# EAGLE design SmartDriveTestStand_SingleCape (EAGLE 9.2.2)
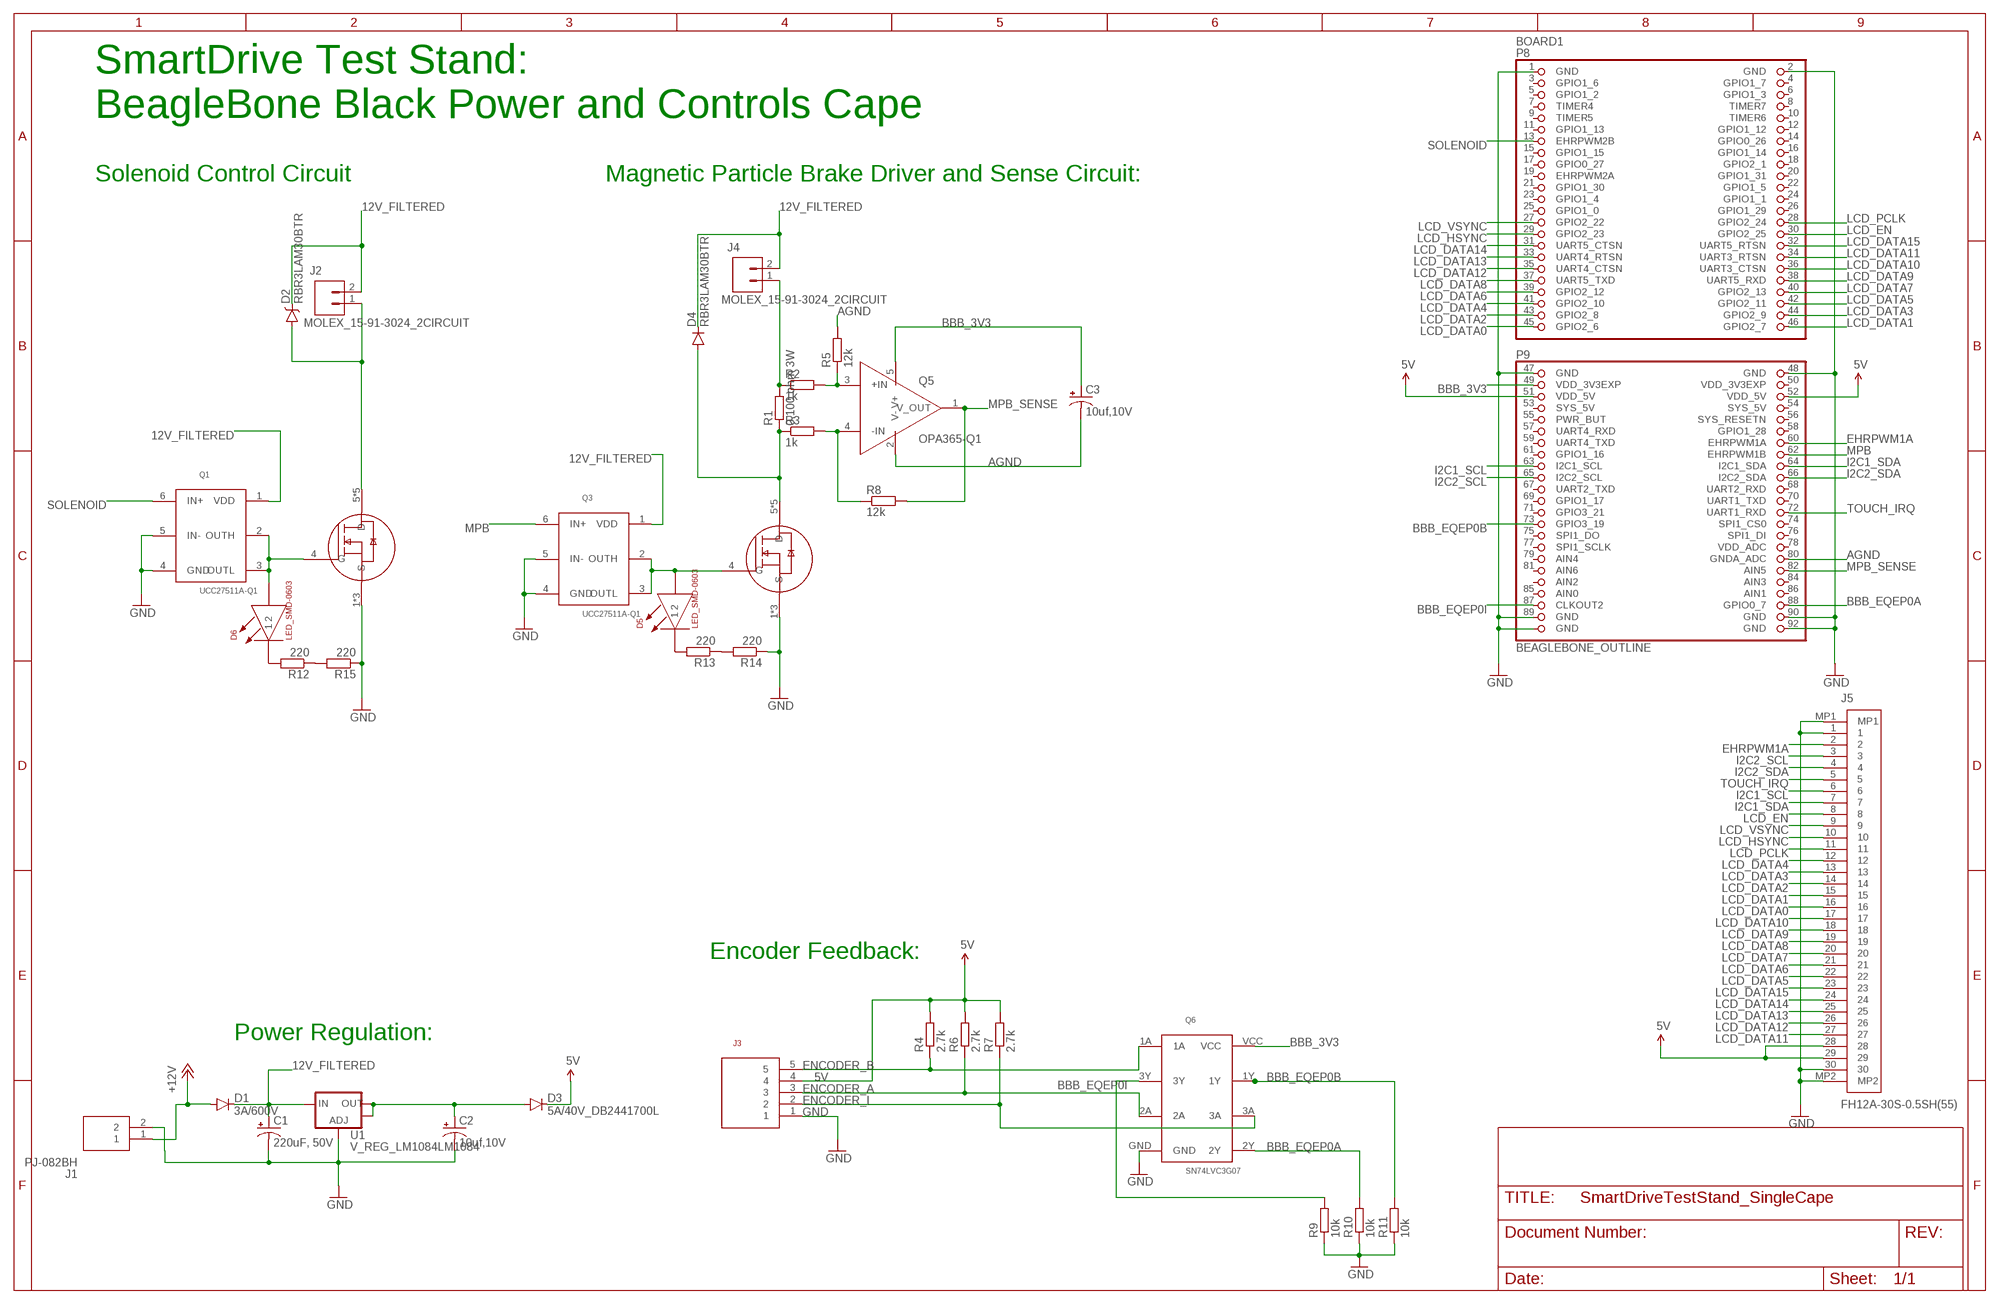
[diagram p0: schematic, sheet 1]

## Parts
BOARD1  BEAGLEBONE_OUTLINE  [BEAGLEBONE_SHIELD]
C1  220uF, 50V  CAP_POLG  [PANASONIC_G]
C2  10uf,10V  CAP_POL1206-KIT  [EIA3216-KIT]
C3  10uf,10V  CAP_POL1206-KIT  [EIA3216-KIT]
D1  3A/600V  DIODEES3J  [SMC]
D2  RBR3LAM30BTR  DIODE-SCHOTTKYRBR3LAM30B  [SMA-DIODE]
D3  5A/40V_DB2441700L  DIODESMA-ALT  [SMA-DIODE_ALT]
D4  RBR3LAM30BTR  DIODESMA  [SMA-DIODE]
D5  LED_SMD-0603  [0603_LED]
D6  LED_SMD-0603  [0603_LED]
J1  PJ-082BH  [PJ-082BH]
J2  MOLEX_15-91-3024_2CIRCUIT  [MOLEX15-91-3024_2CIRCUIT]
J3  MOLEX_15-91-3053_5CIRCUIT  [MOLEX15-91-3053-5CIRCUIT]
J4  MOLEX_15-91-3024_2CIRCUIT  [MOLEX15-91-3024_2CIRCUIT]
J5  FH12A-30S-0.5SH(55)  [FH12A30S05SH55]
Q1  UCC27511A-Q1  [SOT23-6]
Q2  MOSFET_NCHANNELTI_CSD18533Q5A  [SON_5X6MM_NEXFET]
Q3  UCC27511A-Q1  [SOT23-6]
Q4  MOSFET_NCHANNELTI_CSD18533Q5A  [SON_5X6MM_NEXFET]
Q5  OPA365-Q1  [SOT23-5]
Q6  SN74LVC3G07  [SN74LVC3G07]
R1  0.100 ohm 3W  RESISTOR-2512  [RESISTOR-2512]
R2  1k  RESISTOR-0603  [RESISTOR-0603]
R3  1k  RESISTOR-0603  [RESISTOR-0603]
R4  2.7k  RESISTOR-0603  [RESISTOR-0603]
R5  12k  RESISTOR-0603  [RESISTOR-0603]
R6  2.7k  RESISTOR-0603  [RESISTOR-0603]
R7  2.7k  RESISTOR-0603  [RESISTOR-0603]
R8  12k  RESISTOR-0603  [RESISTOR-0603]
R9  10k  RESISTOR-0603  [RESISTOR-0603]
R10  10k  RESISTOR-0603  [RESISTOR-0603]
R11  10k  RESISTOR-0603  [RESISTOR-0603]
R12  220  RESISTOR-0603  [RESISTOR-0603]
R13  220  RESISTOR-0603  [RESISTOR-0603]
R14  220  RESISTOR-0603  [RESISTOR-0603]
R15  220  RESISTOR-0603  [RESISTOR-0603]
U1  V_REG_LM1084LM1084  [TO-263-3]

## Nets
5V: BOARD1.51(VDD_5V) BOARD1.52(VDD_5V) D3.C J3.4 J5.28 J5.29 R4.P$2 R6.P$2 R7.P$2
12V_FILTERED: C1.+ D1.C D2.C D4.C J2.2 J4.2 Q1.1(VDD) Q3.1(VDD) U1.3(IN)
+12V: D1.A J1.1
AGND: BOARD1.80(GNDA_ADC) C3.C(-) Q5.2(V-) R5.P$2
BBB_3V3: BOARD1.49(VDD_3V3EXP) C3.A(+) Q5.5(V+) Q6.VCC
BBB_EQEP0A: BOARD1.88(GPIO0_7) Q6.2Y R10.P$2
BBB_EQEP0B: BOARD1.73(GPIO3_19) Q6.1Y R11.P$2
BBB_EQEP0I: BOARD1.87(CLKOUT2) Q6.3Y R9.P$2
EHRPWM1A: BOARD1.60(EHRPWM1A) J5.2
ENCODER_A: J3.3 Q6.2A R6.P$1
ENCODER_B: J3.5 Q6.1A R4.P$1
ENCODER_I: J3.2 Q6.3A R7.P$1
GND: BOARD1.1(GND) BOARD1.2(GND) BOARD1.47(GND) BOARD1.48(GND) BOARD1.89(GND) BOARD1.90(GND) BOARD1.91(GND) BOARD1.92(GND) C1.- C2.C(-) J1.2 J3.1 J5.1 J5.30 J5.MP1 J5.MP2 Q1.4(GND) Q1.5(IN-) Q2.1(S) Q2.2(S) Q2.3(S) Q3.4(GND) Q3.5(IN-) Q4.1(S) Q4.2(S) Q4.3(S) Q6.GND R9.P$1 R10.P$1 R11.P$1 R14.P$1 R15.P$1 U1.1(ADJ)
I2C1_SCL: BOARD1.63(I2C1_SCL) J5.6
I2C1_SDA: BOARD1.64(I2C1_SDA) J5.7
I2C2_SCL: BOARD1.65(I2C2_SCL) J5.3
I2C2_SDA: BOARD1.66(I2C2_SDA) J5.4
LCD_DATA0: BOARD1.45(GPIO2_6) J5.16
LCD_DATA1: BOARD1.46(GPIO2_7) J5.15
LCD_DATA2: BOARD1.43(GPIO2_8) J5.14
LCD_DATA3: BOARD1.44(GPIO2_9) J5.13
LCD_DATA4: BOARD1.41(GPIO2_10) J5.12
LCD_DATA5: BOARD1.42(GPIO2_11) J5.22
LCD_DATA6: BOARD1.39(GPIO2_12) J5.21
LCD_DATA7: BOARD1.40(GPIO2_13) J5.20
LCD_DATA8: BOARD1.37(UART5_TXD) J5.19
LCD_DATA9: BOARD1.38(UART5_RXD) J5.18
LCD_DATA10: BOARD1.36(UART3_CTSN) J5.17
LCD_DATA11: BOARD1.34(UART3_RTSN) J5.27
LCD_DATA12: BOARD1.35(UART4_CTSN) J5.26
LCD_DATA13: BOARD1.33(UART4_RTSN) J5.25
LCD_DATA14: BOARD1.31(UART5_CTSN) J5.24
LCD_DATA15: BOARD1.32(UART5_RTSN) J5.23
LCD_EN: BOARD1.30(GPIO2_25) J5.8
LCD_HSYNC: BOARD1.29(GPIO2_23) J5.10
LCD_PCLK: BOARD1.28(GPIO2_24) J5.11
LCD_VSYNC: BOARD1.27(GPIO2_22) J5.9
MPB: BOARD1.62(EHRPWM1B) Q3.6(IN+)
MPB_SENSE: BOARD1.82(AIN5) Q5.1(V_OUT) R8.P$2
N$1: R13.P$1 R14.P$2
N$2: D4.A Q4.5(D) Q4.6(D) Q4.7(D) Q4.8(D) Q4.PAD(D) R1.1 R3.P$1
N$3: D5.C R13.P$2
N$4: Q5.3(+IN) R2.P$2 R5.P$1
N$5: Q5.4(-IN) R3.P$2 R8.P$1
N$6: D6.C R12.P$2
N$7: D2.A J2.1 Q2.5(D) Q2.6(D) Q2.7(D) Q2.8(D) Q2.PAD(D)
N$8: J4.1 R1.2 R2.P$1
N$9: R12.P$1 R15.P$2
N$10: D5.A Q3.2(OUTH) Q3.3(OUTL) Q4.4(G)
N$11: D6.A Q1.2(OUTH) Q1.3(OUTL) Q2.4(G)
SOLENOID: BOARD1.13(EHRPWM2B) Q1.6(IN+)
TOUCH_IRQ: BOARD1.72(UART1_RXD) J5.5
VOUT: C2.A(+) D3.A U1.2(OUT) U1.4(OUT)
Unconnected: BOARD1.3(GPIO1_6) BOARD1.4(GPIO1_7) BOARD1.5(GPIO1_2) BOARD1.6(GPIO1_3) BOARD1.7(TIMER4) BOARD1.8(TIMER7) BOARD1.9(TIMER5) BOARD1.10(TIMER6) BOARD1.11(GPIO1_13) BOARD1.12(GPIO1_12) BOARD1.14(GPIO0_26) BOARD1.15(GPIO1_15) BOARD1.16(GPIO1_14) BOARD1.17(GPIO0_27) BOARD1.18(GPIO2_1) BOARD1.19(EHRPWM2A) BOARD1.20(GPIO1_31) BOARD1.21(GPIO1_30) BOARD1.22(GPIO1_5) BOARD1.23(GPIO1_4) BOARD1.24(GPIO1_1) BOARD1.25(GPIO1_0) BOARD1.26(GPIO1_29) BOARD1.54(SYS_5V) BOARD1.55(PWR_BUT) BOARD1.56(SYS_RESETN) BOARD1.57(UART4_RXD) BOARD1.58(GPIO1_28) BOARD1.59(UART4_TXD) BOARD1.61(GPIO1_16) BOARD1.67(UART2_TXD) BOARD1.68(UART2_RXD) BOARD1.69(GPIO1_17) BOARD1.70(UART1_TXD) BOARD1.71(GPIO3_21) BOARD1.74(SPI1_CS0) BOARD1.75(SPI1_DO) BOARD1.76(SPI1_DI) BOARD1.77(SPI1_SCLK) BOARD1.78(VDD_ADC) BOARD1.79(AIN4) BOARD1.81(AIN6) BOARD1.83(AIN2) BOARD1.84(AIN3) BOARD1.86(AIN1)

## Notes on the sheet
- SmartDrive Test Stand: 
  BeagleBone Black Power and Controls Cape
- Solenoid Control Circuit | Magnetic Particle Brake Driver and Sense Circuit:
- Encoder Feedback:
- Power Regulation:

## Power pins joined to a net without a drawn wire
AIN0: BOARD1.85(AIN0)
SYS_5V: BOARD1.53(SYS_5V)
VDD_3V3EXP: BOARD1.50(VDD_3V3EXP)

## Library data of the parts
BOARD1 = SmartDrive-TestStand:BEAGLEBONE_OUTLINE: Should match A3 pinout - but not completely tested
C1 = SmartDrive-TestStand:CAP_POL: Capacitor Polarized These are standard SMD and PTH capacitors. Normally 10uF, 47uF, and 100uF in electrolytic and tantalum varieties. Always verify the external diameter of the through hole cap, it varies with capacity, voltage, and manufacturer. The EIA devices should be standard.; MANEX: 123-0004264
C2 C3 = SmartDrive-TestStand:CAP_POL: Capacitor Polarized These are standard SMD and PTH capacitors. Normally 10uF, 47uF, and 100uF in electrolytic and tantalum varieties. Always verify the external diameter of the through hole cap, it varies with capacity, voltage, and manufacturer. The EIA devices should be standard.; MANEX: 123-0001192
D1 = SmartDrive-TestStand:DIODE: Diode These are standard reverse protection diodes and small signal diodes. SMA package can handle up to about 1A. SOD-323 can handle about 200mA. What the SOD-323 package when ordering, there are some mfgs out there that are 5-pin packages.; MANEX: 130-0001388; PROD_ID: DIO-12441
D2 = SmartDrive-TestStand:DIODE-SCHOTTKY: Schottky diodes
D3 = SmartDrive-TestStand:DIODE: Diode These are standard reverse protection diodes and small signal diodes. SMA package can handle up to about 1A. SOD-323 can handle about 200mA. What the SOD-323 package when ordering, there are some mfgs out there that are 5-pin packages.; MANEX: 130-0002546
D4 = SmartDrive-TestStand:DIODE: Diode These are standard reverse protection diodes and small signal diodes. SMA package can handle up to about 1A. SOD-323 can handle about 200mA. What the SOD-323 package when ordering, there are some mfgs out there that are 5-pin packages.
D5 D6 = SmartDrive-TestStand:LED_SMD-0603
J1 = SmartDrive-TestStand:PJ-082BH: DC Power Connectors 2.5mm x 5.5mm horz Source: Datasheet <https://componentsearchengine.com/Datasheets/1/PJ-082BH.pdf>; DESCRIPTION: DC Power Connectors 2.5mm x 5.5mm horz; HEIGHT: mm; MANUFACTURER_NAME: CUI; MANUFACTURER_PART_NUMBER: PJ-082BH; MOUSER_PART_NUMBER: 490-PJ-082BH
J2 J4 = SmartDrive-TestStand:MOLEX_15-91-3024_2CIRCUIT: MOLEX 15-91-3024 2 position connector; MANEX: 257-0004040
J3 = SmartDrive-TestStand:MOLEX_15-91-3053_5CIRCUIT
J5 = SmartDrive-TestStand:FH12A-30S-0.5SH(55): Hirose FH12 Series 0.5mm Pitch 30 Way 1 Row Right Angle SMT Female FPC Connector, Gold Plated Contacts Source: Datasheet <https://www.hirose.com/product/en/download_file/key_name/FH12A-30S-0.5SH(55)/category/Drawing (2D)/doc_file_id/43793/?file_category_id=6&item_id=05860556555&is_series=>; ARROW_PART_NUMBER: FH12A-30S-0.5SH(55); ARROW_PRICE-STOCK: https://www.arrow.com/en/products/fh12a-30s-0.5sh-55/hirose-electric; DESCRIPTION: Hirose FH12 Series 0.5mm Pitch 30 Way 1 Row Right Angle SMT Female FPC Connector, Gold Plated Contacts; HEIGHT: 3.6mm; MANUFACTURER_NAME: Hirose; MANUFACTURER_PART_NUMBER: FH12A-30S-0.5SH(55); RS_PART_NUMBER: 7148083P; RS_PRICE-STOCK: http://uk.rs-online.com/web/p/products/7148083P
Q1 Q3 = SmartDrive-TestStand:UCC27511A-Q1
Q2 Q4 = SmartDrive-TestStand:MOSFET_NCHANNEL: N-Channel QFET MOSFET FQB30N06L 60V, 32A, 35mOhm
Q5 = SmartDrive-TestStand:OPA365-Q1: OPA365-Q1 50MHz Low-Distortion High-CMRR Rail-to-Rail I/O, Single-Supply Operational Amplifier
Q6 = SmartDrive-TestStand:SN74LVC3G07
R1 = SmartDrive-TestStand:RESISTOR-2512: Resistor SMD 2512
R2-R15 = SmartDrive-TestStand:RESISTOR-0603: Resistor 0603 SMD
U1 = SmartDrive-TestStand:V_REG_LM1084: LM1084 5A low-drop positive voltage regulator The LM1084xx is a low drop voltage regulator able to provide up to 5 A of output current. Dropout is guaranteed at a maximum of 1.5 V at the maximum output current, decreasing at lower loads. The LM1084xx is pin to pin compatible with the older 3-terminal adjustable regulators, but has better performances in term of drop and output tolerance.

## Net classes
0 default: width 0.152 mm, drill 0.305 mm, clearance 0.152 mm

## Board
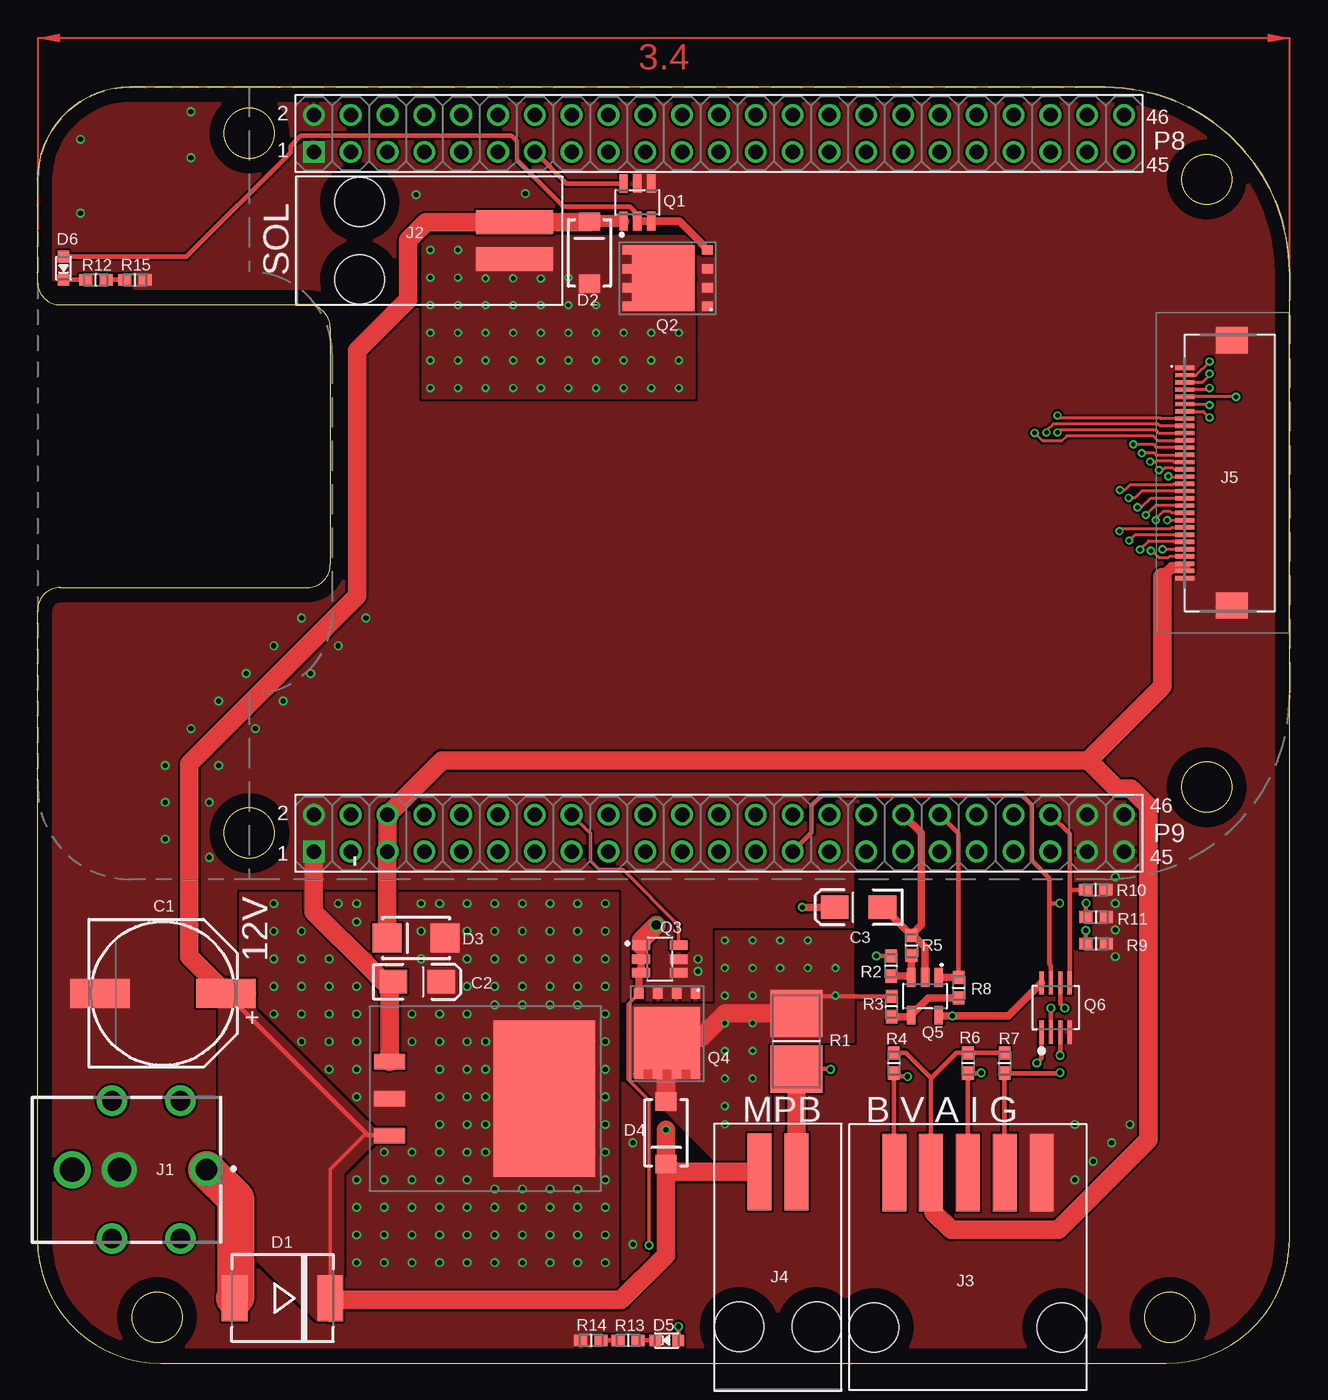
[diagram p1: board, top side]
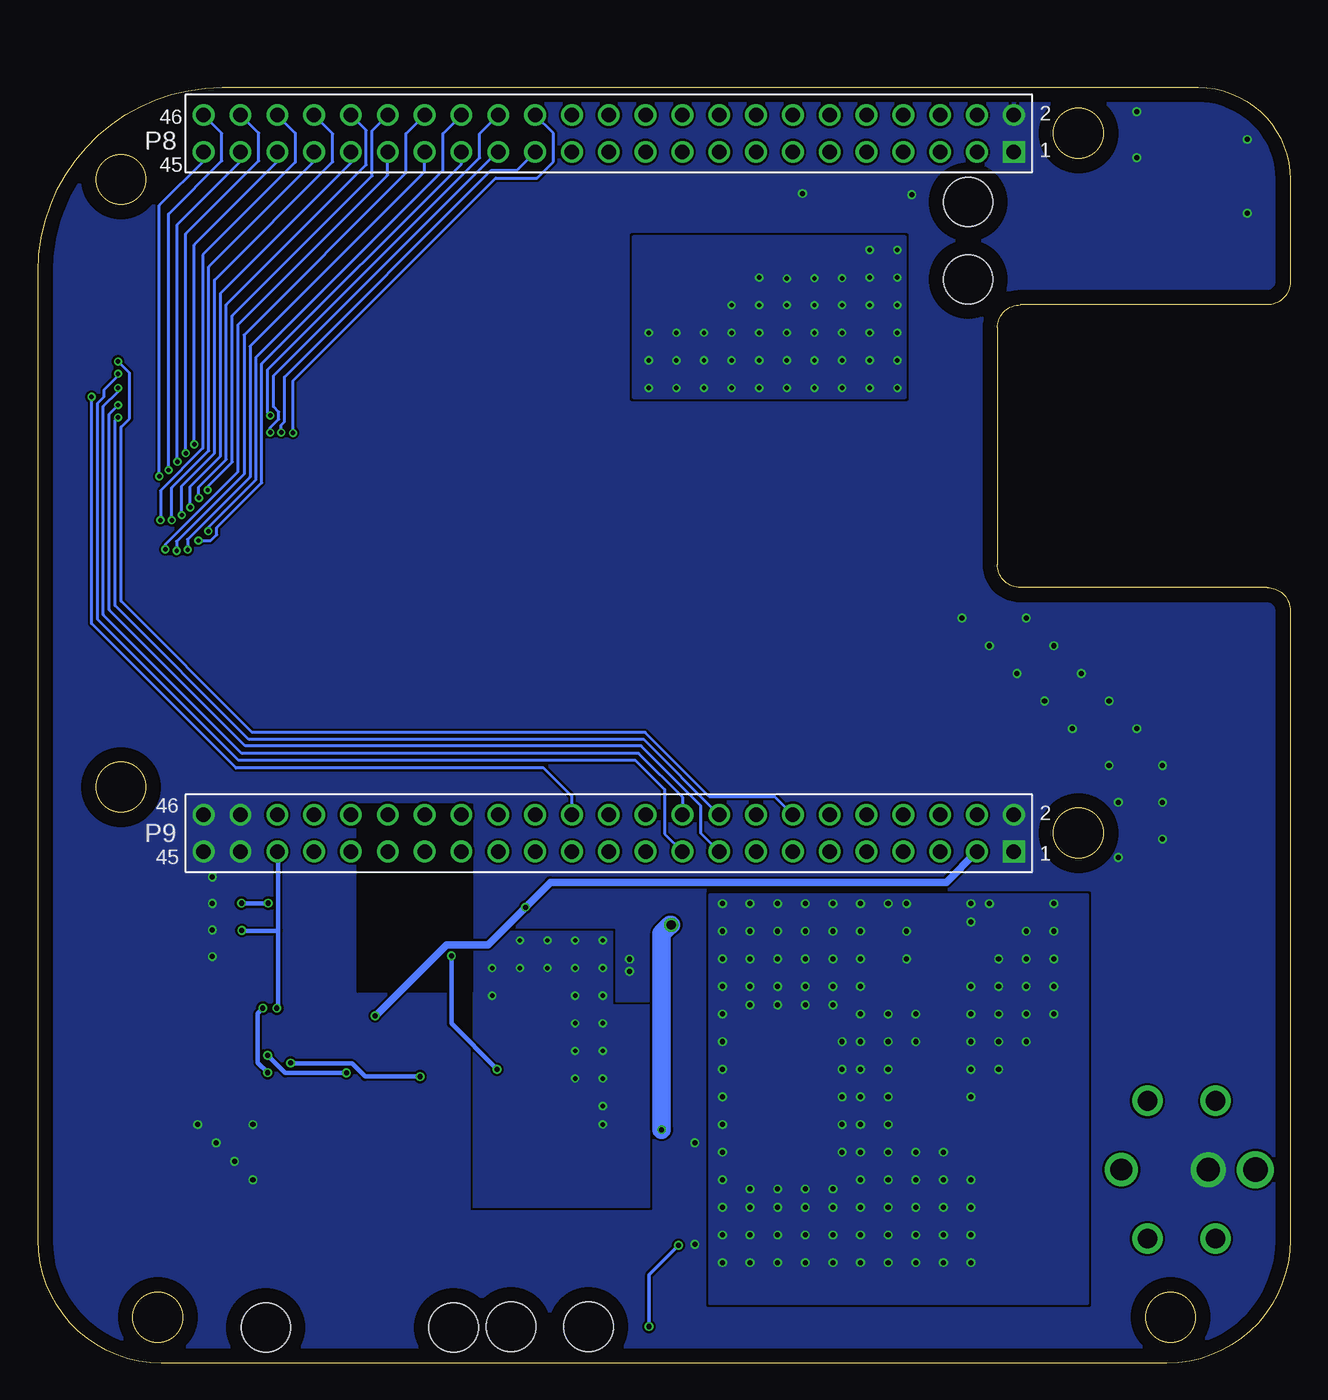
[diagram p2: board, bottom side, seen from below]

Size 86.36 x 88 mm. Coordinates in mm from the lower left corner, seen from the top.
Outline: 0,8.5 arc90 8.5,0 77.86,0 arc90 86.36,8.5 86.36,75.3 arc90 73.66,88 6.35,88 arc90 0,81.65 0,74.59 arc90 1.59,73 18.61,73 arc-90 20.2,71.41 20.2,55.09 arc-90 18.61,53.5 1.59,53.5 arc90 0,51.91 0,8.5
Outline: circle at 14.61,84.83 radius 1.73
Outline: circle at 80.65,81.65 radius 1.73
Outline: circle at 80.65,39.74 radius 1.73
Outline: circle at 14.61,36.56 radius 1.73
Outline: circle at 8.26,3.17 radius 1.73
Outline: circle at 78.11,3.17 radius 1.73
Copper layers (1*16): Top 0.035mm / dielectric 1.5mm / Bottom 0.035mm
Design rules "default *": minimum track width 6mil, minimum drill 10mil, track to track 6mil, track to pad 6mil, pad to pad 6mil, via to via 6mil, smd to smd 6mil, copper to edge 40mil, drill to drill 6mil, minimum pad ring 5mil, minimum via ring 5mil, stop-mask expansion 4mil, vias tented up to drill 0mil, thermal gap 0mil

### Footprints (pad centres in the part's own frame; a part is rotated, then mirrored left to right if it is on the bottom)
BEAGLEBONE_SHIELD = drill 1 square: 1 4.445,19.05; 47 52.705,19.05 | drill 1: 2 1.905,19.05; 3 4.445,21.59; 4 1.905,21.59; 5 4.445,24.13; 6 1.905,24.13; 7 4.445,26.67; 8 1.905,26.67; 9 4.445,29.21; 10 1.905,29.21; 11 4.445,31.75; 12 1.905,31.75; 13 4.445,34.29; 14 1.905,34.29; 15 4.445,36.83; 16 1.905,36.83; 17 4.445,39.37; 18 1.905,39.37; 19 4.445,41.91; 20 1.905,41.91; 21 4.445,44.45; 22 1.905,44.45; 23 4.445,46.99; 24 1.905,46.99; 25 4.445,49.53; 26 1.905,49.53; 27 4.445,52.07; 28 1.905,52.07; 29 4.445,54.61; 30 1.905,54.61; 31 4.445,57.15; 32 1.905,57.15; 33 4.445,59.69; 34 1.905,59.69; 35 4.445,62.23; 36 1.905,62.23; 37 4.445,64.77; 38 1.905,64.77; 39 4.445,67.31; 40 1.905,67.31; 41 4.445,69.85; 42 1.905,69.85; 43 4.445,72.39; 44 1.905,72.39; 45 4.445,74.93; 46 1.905,74.93; 48 50.165,19.05; 49 52.705,21.59; 50 50.165,21.59; 51 52.705,24.13; 52 50.165,24.13; 53 52.705,26.67; 54 50.165,26.67; 55 52.705,29.21; 56 50.165,29.21; 57 52.705,31.75; 58 50.165,31.75; 59 52.705,34.29; 60 50.165,34.29; 61 52.705,36.83; 62 50.165,36.83; 63 52.705,39.37; 64 50.165,39.37; 65 52.705,41.91; 66 50.165,41.91; 67 52.705,44.45; 68 50.165,44.45; 69 52.705,46.99; 70 50.165,46.99; 71 52.705,49.53; 72 50.165,49.53; 73 52.705,52.07; 74 50.165,52.07; 75 52.705,54.61; 76 50.165,54.61; 77 52.705,57.15; 78 50.165,57.15; 79 52.705,59.69; 80 50.165,59.69; 81 52.705,62.23; 82 50.165,62.23; 83 52.705,64.77; 84 50.165,64.77; 85 52.705,67.31; 86 50.165,67.31; 87 52.705,69.85; 88 50.165,69.85; 89 52.705,72.39; 90 50.165,72.39; 91 52.705,74.93; 92 50.165,74.93
PANASONIC_G = smd 4.1 x 2: + 4.35,0; - -4.35,0
EIA3216-KIT = smd 1.9 x 1.6: A 1.65,0; C -1.65,0
SMC = smd 1.778 x 3.175: A 3.302,0; C -3.302,0
SMA-DIODE = smd 1.27 x 1.47: A -2.15,0; C 2.15,0
SMA-DIODE_ALT = smd 2 x 2: A -2,0; C 2,0
0603_LED = smd 0.8 x 0.8: A 0.8,0; C -0.8,0
PJ-082BH = drill 1.5 pad 2.3: 1 12,0 | drill 1.61 pad 2.4: 2 6,0 | drill 1.7 pad 2.5: 3 2.75,0 | drill 1.35 pad 2.1: 4 5.5,4.75; 5 10.2,4.75; 6 10.2,-4.75; 7 5.5,-4.75
MOLEX15-91-3024_2CIRCUIT = smd 1.65 x 5.33: 1 1.27,10.69; 2 -1.27,10.69 | hole 3.4: 2.67,0; -2.67,0
MOLEX15-91-3053-5CIRCUIT = smd 1.65 x 5.33: 1 5.08,10.69; 2 2.54,10.69; 3 0,10.69; 4 -2.54,10.69; 5 -5.08,10.69 | hole 3.4: 6.48,0; -6.48,0
FH12A30S05SH55 = smd 0.3 x 1.3: 1 -7.25,-2.625; 2 -6.75,-2.625; 3 -6.25,-2.625; 4 -5.75,-2.625; 5 -5.25,-2.625; 6 -4.75,-2.625; 7 -4.25,-2.625; 8 -3.75,-2.625; 9 -3.25,-2.625; 10 -2.75,-2.625; 11 -2.25,-2.625; 12 -1.75,-2.625; 13 -1.25,-2.625; 14 -0.75,-2.625; 15 -0.25,-2.625; 16 0.25,-2.625; 17 0.75,-2.625; 18 1.25,-2.625; 19 1.75,-2.625; 20 2.25,-2.625; 21 2.75,-2.625; 22 3.25,-2.625; 23 3.75,-2.625; 24 4.25,-2.625; 25 4.75,-2.625; 26 5.25,-2.625; 27 5.75,-2.625; 28 6.25,-2.625; 29 6.75,-2.625; 30 7.25,-2.625 | smd 1.8 x 2.2: MP1 -9.15,0.625; MP2 9.15,0.625
SOT23-6 = smd 1.27 x 0.635: 1 -1.3,0.95; 2 -1.3,0; 3 -1.3,-0.95; 4 1.3,-0.95; 5 1.3,0; 6 1.3,0.95
SON_5X6MM_NEXFET = smd 0.75 x 0.65: 1 3.075,-1.95; 2 3.075,-0.65; 3 3.075,0.65; 4 3.075,1.95 | smd 0.65 x 0.65: 5 -2.475,1.95; 6 -2.475,0.65; 7 -2.475,-0.65; 8 -2.475,-1.95 | smd 4.3 x 4.55: PAD 0,0
SOT23-5 = smd 1.27 x 0.635: 1 -1.3,0.95; 2 -1.3,0; 3 -1.3,-0.95; 4 1.3,-0.95; 5 1.3,0.95
SN74LVC3G07 = smd 0.3 x 1.6: 1A -0.975,-1.7; 1Y -0.325,1.7; 2A 0.325,-1.7; 2Y 0.975,1.7; 3A 0.325,1.7; 3Y -0.325,-1.7; GND 0.975,-1.7; VCC -0.975,1.7
RESISTOR-2512 = smd 3.25 x 3.6: 1 -1.925,0; 2 1.925,0
RESISTOR-0603 = smd 0.9 x 0.8: P$1 -0.7,0; P$2 0.7,0
TO-263-3 = smd 1.07 x 2.16: 1 -2.54,-14.17; 2 0,-14.17; 3 2.54,-14.17 | smd 10.8 x 7: 4 0,-3.5

### Placement (x,y rotation side)
BOARD1  0.01,88 270 top
C1  8.66,25.52 0 top
C2  26.2,26.31 0 top
C3  56.63,31.45 180 top
D1  16.9,4.49 180 top
D2  38.07,76.59 90 top
D3  26.11,29.32 180 top
D4  43.36,15.89 270 top
D5  43.4,1.58 0 top
D6  1.8,75.52 90 top
DRILEGEND  [DRILEGEND]  10.55,33.13 0 top
J1  -0.35,13.35 0 top
J2  22.22,77.43 270 top
J3  64.18,2.47 0 top
J4  51.07,2.51 0 top
J5  81.76,61.4 270 top
Q1  41.37,80.07 90 top
Q2  43.15,74.83 0 top
Q3  42.93,27.88 0 top
Q4  43.44,22.43 90 top
Q5  61.22,25.32 270 top
Q6  70.23,24.54 0 top
R1  52.34,22.22 270 top
R2  58.88,27.4 270 top
R3  58.91,24.61 270 top
R4  59.06,20.71 90 top
R5  60.28,28.82 90 top
R6  64.17,20.71 90 top
R7  66.7,20.71 90 top
R8  63.53,25.9 90 top
R9  73.02,28.94 180 top
R10  72.99,32.66 180 top
R11  73.02,30.79 180 top
R12  4.03,74.72 180 top
R13  40.74,1.58 0 top
R14  38.17,1.58 0 top
R15  6.73,74.72 180 top
U1  38.45,18.25 270 top

### Tracks (layer width: path | path; a pad name or v marks a point on that pad's centre or on a via)
5V
  Top 0.254: 79.14,54.88 J5.29 J5.28
  Top 0.305: R7.P$2 R6.P$2 63.39,21.41 61.64,19.66 J3.4 61.64,19.67 59.9,21.41 R4.P$2
  Top 0.762: 77.59,54.24 78.24,54.88 79.14,54.88
  Top 1.27: 72.49,41.59 27.9,41.59 BOARD1.52 BOARD1.51 24.11,35.26 D3.C | 72.49,41.59 77.59,46.69 77.59,54.24 | 72.49,41.59 74.43,39.65 75.4,39.65 76.61,38.44 76.61,15.4 70.41,9.2 63.03,9.2 61.8,10.42 61.8,12.99 J3.4
12V_FILTERED  (via drill 0.35, 0.65)
  Top 0.254: D1.C 20.2,13.38 22.53,15.71 U1.3
  Top 0.305: C1.+ 22.82,15.71 U1.3
  Top 0.508: 38.19,78.77 38.11,78.7
  Top 0.813: Q1.1 38.19,78.77
  Top 1.27: C1.+ 10.47,28.06 10.47,41.33 22.04,52.9 22.04,69.84 25.57,73.37 25.57,77.45 26.82,78.69 J2.2 38.03,78.69 D2.C 38.11,78.7 | D4.C 43.36,7.45 40.27,4.36 20.33,4.36 D1.C | D4.C 43.89,13.2 J4.2 | D4.C v43.36,16.11 v43.35,16.11 | Q3.1 arc0 41.63,29.17 v42.69,30.23
  Bottom 1.27: v43.35,16.11 43.35,29.65 42.77,30.23 v42.69,30.23
  pour Top: 12.49,26.52 12.49,9.73 19.33,2.9 21.1,2.9 21.1,13.09 23.19,15.17 23.19,16.21 15.06,24.34 15.06,26.52
+12V
  Top 2.54: J1.1 13.67,11.32 13.67,4.56 D1.A
AGND
  Top 0.508: R5.P$2 60.96,30.22 60.96,36.57 BOARD1.80 | R5.P$2 58.35,31.45 C3.C | R5.P$2 60.4,29.52 61.22,28.71 Q5.2
AGND_CUTOUT
  cutout Top: 56.43,25.61 56.43,38.56 63.55,38.56 63.55,25.61
  cutout Bottom: 56.43,38.56 56.43,25.61 64.31,25.61 64.31,38.56
BBB_3V3  (via drill 0.35)
  Top 0.508: v52.75,31.45 C3.A | Q6.VCC 66.97,23.96 v63.11,23.96 62.23,23.96 Q5.5
  Bottom 0.508: v63.11,23.96 63.09,23.96 58.19,28.86 55.34,28.86 v52.75,31.45 51.02,33.18 23.72,33.18 BOARD1.49
BBB_EQEP0A
  Top 0.305: Q6.2Y 71.2,32.52 | 71.2,32.52 71.2,36.49 BOARD1.88 | R10.P$2 71.34,32.66 71.2,32.52
BBB_EQEP0B  (via drill 0.35)
  Top 0.305: 69.8,31.73 69.8,27.54 69.9,27.44 Q6.1Y | 69.8,31.73 69.8,33.45 68.58,34.68 68.58,38.51 67.92,39.17 54.1,39.17 53.39,38.46 53.39,36.61 BOARD1.73 | R11.P$2 72.32,31.71 v72.33,31.73 | v70.5,31.73 69.8,31.73
  Bottom 0.305: v72.33,31.73 v70.5,31.73
BBB_EQEP0I  (via drill 0.35)
  Top 0.305: Q6.3Y v69.9,24.49 | R9.P$2 72.31,28.95 v72.31,29.85
  Bottom 0.305: 69.79,29.83 72.29,29.83 v72.31,29.85 | 69.79,29.83 69.79,24.59 v69.9,24.49 | BOARD1.87 69.79,35.22 69.79,29.83
EHRPWM1A  (via drill 0.3)
  Top 0.203: J5.2 79.9,68.15 v80.84,69.09
  Bottom 0.203: v80.84,69.09 80.06,68.31 80.06,65.16 80.64,64.58 80.64,52.56 71.6,43.52 44.49,43.52 40.07,39.1 35.57,39.1 BOARD1.60
ENCODER_A  (via drill 0.35)
  Top 0.305: J3.3 R6.P$1 65.08,20.01 v65.1,20.02 | v70.53,21.24 70.55,21.26 Q6.2A
  Bottom 0.305: v65.1,20.02 69.32,20.02 v70.53,21.24
ENCODER_B  (via drill 0.35)
  Top 0.305: J3.5 59.06,13.2 R4.P$1 59.3,19.77 v60.01,19.77 | v68.94,20.7 69.25,21.02 Q6.1A
  Bottom 0.305: v60.01,19.77 63.81,19.77 64.72,20.68 68.91,20.68 v68.94,20.7
ENCODER_I  (via drill 0.35)
  Top 0.305: J3.2 66.7,13.18 R7.P$1 70.49,20.01 v70.53,20.05 | Q6.3A 70.56,24.8 v70.86,24.49
  Bottom 0.305: v70.86,24.49 71.22,24.14 71.22,20.94 71.22,20.73 v70.53,20.05
GND  (via drill 0.35)
  Top 1.27: U1.1 24.28,26.04 C2.C 23.89,26.31 22.91,27.29 19.06,31.13 BOARD1.47
  other vias: 75.36,16.47 74.09,15.2 72.82,13.93 71.55,12.66 71.55,16.47 74.34,28.05 74.34,29.89 74.34,31.71 74.34,33.53 45.56,27.87 45.56,27.03 15.03,43.77 16.94,45.68 18.84,47.58 20.75,49.49 22.65,51.39 18.21,51.39 16.3,49.49 14.4,47.58 12.49,45.68 10.59,43.77 8.81,41.23 8.81,38.69 8.81,36.15 12.49,41.23 11.86,38.69 11.86,34.88 41.07,15.2 41.07,8.21 26.11,80.6 33.65,80.68 10.59,83.14 10.59,86.32 2.97,84.41 2.97,79.33
  pour Bottom (rank 6): -0.34,89.01 -0.34,-1.49 91.2,-1.49 91.2,89.01
  pour Top (rank 6): -0.11,89.01 -0.11,-1.41 91.17,-1.41 91.17,89.01
I2C1_SCL  (via drill 0.3)
  Top 0.203: J5.6 79.16,66.13 80.8,66.13 v80.84,66.08
  Bottom 0.203: v80.84,66.08 81.45,65.47 81.45,51.96 72.07,42.58 44.78,42.58 40.66,38.46 40.66,36.57 BOARD1.63
I2C1_SDA  (via drill 0.3)
  Top 0.203: J5.7 80.43,65.65 v80.84,65.23
  Bottom 0.203: BOARD1.64 44.59,43.03 71.82,43.03 81.05,52.26 81.05,65.03 v80.84,65.23
I2C2_SCL  (via drill 0.3)
  Top 0.203: J5.3 80.33,67.65 80.84,68.16 v80.84,68.24
  Bottom 0.203: v80.84,68.24 80.84,68.1 81.81,67.14 81.81,66.66 82.27,66.21 82.27,51.31 72.54,41.59 45.16,41.59 43.15,39.58 43.15,36.52 BOARD1.65
I2C2_SDA  (via drill 0.3)
  Top 0.203: J5.4 80.73,67.15 v80.84,67.27
  Bottom 0.203: v80.84,67.27 80.84,67.02 81.86,66.01 81.86,51.61 72.32,42.07 44.94,42.07 41.92,39.05 BOARD1.66
LCD_DATA0  (via drill 0.3)
  Top 0.203: J5.16 79.11,61.13 78.04,61.13 v78,61.17
  Bottom 0.203: v78,61.17 78,79.86 74.94,82.92 BOARD1.45
LCD_DATA1  (via drill 0.3)
  Top 0.203: v77.36,61.6 77.41,61.65 77.65,61.65 77.75,61.75 78.3,61.75 78.4,61.65 J5.15
  Bottom 0.203: v77.36,61.6 77.36,79.25 73.69,82.93 73.69,84.83 BOARD1.46
LCD_DATA2  (via drill 0.3)
  Top 0.203: v76.75,62.19 76.79,62.15 77.11,62.15 77.17,62.21 78.34,62.21 78.4,62.15 J5.14
  Bottom 0.203: v76.75,62.19 76.75,78.54 72.4,82.89 BOARD1.43
LCD_DATA3  (via drill 0.3)
  Top 0.203: v76.17,62.77 77.04,62.77 77.19,62.62 79.11,62.62 J5.13
  Bottom 0.203: v76.17,62.77 76.17,77.91 71.14,82.94 71.14,84.84 72.39,86.09 BOARD1.44
LCD_DATA4  (via drill 0.3)
  Top 0.203: J5.12 77.19,63.15 76.98,63.35 75.61,63.35 v75.59,63.38
  Bottom 0.203: v75.59,63.38 75.59,77.14 69.86,82.87 BOARD1.41
LCD_DATA5  (via drill 0.3)
  Top 0.203: v77.92,58.15 J5.22
  Bottom 0.203: BOARD1.42 68.63,84.85 68.63,82.84 75,76.46 75,63.11 77.92,60.19 v77.92,58.15
LCD_DATA6  (via drill 0.3)
  Top 0.203: J5.21 78.22,58.65 78.14,58.73 77.62,58.73 77.14,58.25 v77.14,58.15
  Bottom 0.203: v77.14,58.15 77.14,60.39 74.6,62.93 74.6,75.62 67.32,82.89 BOARD1.39
LCD_DATA7  (via drill 0.3)
  Top 0.203: J5.20 77.1,59.15 v76.45,58.5
  Bottom 0.203: v76.45,58.5 76.45,60.5 74.19,62.76 74.19,74.71 66.04,82.86 66.04,84.8 BOARD1.40
LCD_DATA8  (via drill 0.3)
  Top 0.203: J5.19 76.76,59.65 76.14,59.04 v75.87,59.04
  Bottom 0.203: v75.87,59.04 75.87,60.48 73.78,62.56 73.78,73.79 64.78,82.79 BOARD1.37
LCD_DATA9  (via drill 0.3)
  Top 0.203: J5.18 76.17,60.15 75.7,59.69 v75.27,59.69
  Bottom 0.203: v75.27,59.69 75.27,60.45 73.38,62.34 73.38,73.01 63.72,82.66 63.72,85.03 BOARD1.38
LCD_DATA10  (via drill 0.3)
  Top 0.203: J5.17 78.38,60.65 78.3,60.57 75.35,60.57 74.99,60.22 v74.66,60.22
  Bottom 0.203: v74.66,60.22 74.66,60.47 72.97,62.17 72.97,72.25 63.32,81.9 63.32,85.02 BOARD1.36
LCD_DATA11  (via drill 0.3)
  Top 0.203: J5.27 78.09,55.66 77.99,55.56 77.35,55.56 76.86,56.04 v76.81,56.04
  Bottom 0.203: v76.81,56.04 76.81,56.67 72.16,61.32 72.16,70.93 60.99,82.1 60.99,84.81 BOARD1.34
LCD_DATA12  (via drill 0.3)
  Top 0.203: J5.26 77.6,56.15 v77.59,56.14
  Bottom 0.203: v77.59,56.14 77.59,56.46 72.56,61.49 72.56,71.63 62.24,81.95 BOARD1.35
LCD_DATA13  (via drill 0.3)
  Top 0.203: v76.05,56.12 76.65,56.72 78.35,56.72 78.43,56.65 J5.25
  Bottom 0.203: v76.05,56.12 76.05,56.83 71.75,61.12 71.75,70.14 59.7,82.18 BOARD1.33
LCD_DATA14  (via drill 0.3)
  Top 0.203: J5.24 75.71,57.15 v75.3,56.74
  Bottom 0.203: v75.3,56.74 74.45,56.74 74.04,57.15 74.04,57.63 70.94,60.74 70.94,68.94 57.16,82.72 BOARD1.31
LCD_DATA15  (via drill 0.3)
  Top 0.203: v74.63,57.39 74.8,57.56 78.16,57.56 78.25,57.65 J5.23
  Bottom 0.203: v74.63,57.39 74.63,57.64 71.34,60.93 71.34,69.37 58.44,82.28 58.44,84.81 BOARD1.32
LCD_EN  (via drill 0.3)
  Top 0.203: v70.35,65.37 70.52,65.2 77.46,65.2 77.51,65.15 J5.8
  Bottom 0.203: v70.35,65.37 70.53,65.55 70.53,68.52 55.9,83.15 55.9,84.81 BOARD1.30
LCD_HSYNC  (via drill 0.3)
  Top 0.203: J5.10 77.36,64.15 77.13,64.38 70.54,64.38 v70.35,64.19
  Bottom 0.203: v70.35,64.19 70.35,64.52 69.77,65.11 69.77,65.61 70.13,65.97 70.13,68.1 54.68,83.55 BOARD1.29
LCD_PCLK  (via drill 0.3)
  Top 0.203: J5.11 79.09,63.61 77.31,63.61 76.95,63.96 70.98,63.96 70.63,63.61 69.34,63.61 v68.78,64.17
  Bottom 0.203: v68.78,64.17 68.78,67.77 54.81,81.74 51.96,81.74 50.82,82.89 50.82,84.83 BOARD1.28
LCD_VSYNC  (via drill 0.3)
  Top 0.203: J5.9 77.44,64.65 77.3,64.79 70.06,64.79 69.59,64.32 v69.59,64.19
  Bottom 0.203: v69.59,64.19 69.59,64.71 69.36,64.94 69.36,68.03 55.11,82.28 53.33,82.28 52.08,83.53 BOARD1.27
MPB
  Top 0.254: BOARD1.62 38.13,36.54 38.13,34.66 38.75,34.04 40.38,34.04 44.23,30.19 Q3.6
MPB_SENSE
  Top 0.305: R8.P$2 63.53,36.55 BOARD1.82
  Top 0.508: Q5.1 63.51,26.62 R8.P$2
N$1
  Top 0.305: R13.P$1 R14.P$2
N$2  (via drill 0.3)
  Top 0.254: Q4.6 43.36,19.38 D4.A
  Top 0.305: R1.1 53.51,25.31 R3.P$1
  Top 0.762: Q4.5 Q4.6 Q4.7 Q4.8
  Top 1.27: R1.1 47.45,24.14 45.73,22.43 Q4.PAD 43.36,22.35 D4.A
  other vias: 47.42,29.17 49.32,29.17 51.23,29.17 53.13,29.17 47.42,27.26 49.32,27.26 51.23,27.26 53.13,27.26 55.04,27.26 55.04,25.36 49.32,25.36 49.32,23.45 49.32,21.55 49.32,19.64 47.42,17.74 47.42,16.47 47.42,19.64 47.42,21.55 47.42,23.45 47.42,25.36
  pour Top: 41.07,24.72 41.07,19.64 46.78,13.93 50.59,13.93 50.59,22.18 56.31,22.18 56.31,29.8 46.78,29.8 46.78,24.72
  pour Bottom: 46.78,29.8 46.78,24.72 42.87,24.72 42.87,19.64 44.24,19.64 44.24,10.75 56.31,10.75 56.31,29.8
N$3
  Top 0.305: D5.C R13.P$2
N$4
  Top 0.508: R2.P$2 60.19,26.7 Q5.3 60.27,28.11 R5.P$1
N$5
  Top 0.508: R3.P$2 60.16,23.91 Q5.4 61.45,25.2 R8.P$1
N$6
  Top 0.305: D6.C | D6.C R12.P$2
N$7  (via drill 0.3)
  Top 0.254: Q2.7 42.5,74.18 Q2.PAD
  other vias: 27.1,67.27 29,67.27 30.91,67.27 32.81,67.27 34.72,67.27 36.62,67.27 38.53,67.27 40.43,67.27 42.34,67.27 44.24,67.27 44.24,69.17 44.24,71.08 42.34,71.08 40.43,71.08 38.53,71.08 38.53,72.98 27.1,69.17 27.1,71.08 27.1,72.98 27.1,74.89 27.1,76.79 29,76.79 29,74.89 29,72.98 29,71.08 29,69.17 30.91,69.17 30.91,71.08 30.91,72.98 30.91,74.84 32.81,74.84 32.81,72.98 32.81,71.08 32.81,69.17 34.72,69.17 34.72,71.08 34.72,72.98 34.72,74.81 36.62,74.89 36.62,72.98 36.62,71.08 36.62,69.17 38.53,69.17 40.43,69.17 42.34,69.17
  pour Top: 26.59,77.73 45.28,77.73 45.28,66.58 26.59,66.58
  pour Bottom: 26.59,66.58 45.28,66.58 45.28,77.73 26.59,77.73
N$8  (via drill 0.35)
  Top 0.305: R1.2 54.71,20.29 v54.71,20.28 | v57.86,28.1 R2.P$1
  Top 1.27: J4.1 R1.2
  Bottom 0.305: v54.71,20.28 57.86,23.43 v57.86,28.1
N$9
  Top 0.305: R12.P$1 R15.P$2
N$10  (via drill 0.35)
  Top 0.254: Q4.4 40.72,24.74 40.72,19.58 42.19,18.12 v42.19,8.13
  Top 0.305: v44.22,2.53 44.22,1.59 D5.A
  Top 0.508: Q4.4 41.48,26.79 Q3.3 Q3.2
  Bottom 0.254: v42.19,8.13 44.22,6.1 v44.22,2.53
N$11
  Top 0.305: Q1.2 41.18,78.96 41.18,79.45 40.87,79.76 36.28,79.76 33.07,82.97 33.07,84.28 32.69,84.66 18.17,84.66 17.45,83.94 17.45,83.51 10.26,76.32 D6.A
  Top 0.508: Q2.4 45.76,77.25 45.76,77.3 44.29,78.77 Q1.3 Q1.2
SOLENOID
  Top 0.305: Q1.6 36.49,81.37 BOARD1.13
TOUCH_IRQ  (via drill 0.3)
  Top 0.203: J5.5 79.17,66.68 80.34,66.68 82.65,66.68 v82.67,66.66
  Bottom 0.203: v82.67,66.66 82.67,65.08 82.67,51.01 72.72,41.05 51.49,41.05 49.54,39.1 BOARD1.72
VOUT  (via drill 0.35)
  other vias: 39.16,31.71 39.16,29.8 39.16,27.9 39.16,25.99 39.16,24.09 39.16,22.18 39.16,20.28 39.16,18.37 39.16,16.47 39.16,14.56 39.16,12.66 39.16,10.75 39.16,8.85 39.16,6.94 37.26,31.71 35.35,31.71 33.45,31.71 31.54,31.71 29.64,31.71 27.73,31.71 26.46,31.71 20.75,31.71 22.02,31.71 29.64,6.94 29.64,8.85 29.64,10.75 29.64,12.66 29.64,14.56 29.64,16.47 29.64,18.37 29.64,20.28 29.64,22.18 29.64,24.09 29.64,25.99 29.64,27.9 29.64,29.8 31.54,29.8 33.45,29.8 35.35,29.8 37.26,29.8 37.26,27.9 35.35,27.9 33.45,27.9 31.54,27.9 31.54,25.99 33.45,25.99 35.35,25.99 37.26,25.99 37.26,24.72 35.35,24.72 33.45,24.72 31.54,24.72 37.26,12.02 35.35,12.02 33.45,12.02 31.54,12.02 31.54,10.75 33.45,10.75 35.35,10.75 37.26,10.75 37.26,8.85 35.35,8.85 33.45,8.85 31.54,8.85 31.54,6.94 33.45,6.94 35.35,6.94 37.26,6.94 27.73,6.94 25.83,6.94 23.92,6.94 22.02,6.94 22.02,8.85 23.92,8.85 25.83,8.85 27.73,8.85 27.73,10.75 25.83,10.75 23.92,10.75 22.02,10.75 22.02,12.66 23.92,12.66 25.83,12.66 27.73,12.66 27.73,14.56 25.83,14.56 23.92,14.56 27.73,16.47 27.73,18.37 27.73,20.28 27.73,22.18 25.83,22.18 25.83,24.09 27.73,24.09 22.02,30.44 30.91,22.18 30.91,20.28 30.91,18.37 30.91,16.47 30.91,14.56 22.02,20.28 20.11,20.28 20.11,22.18 22.02,22.18 22.02,24.09 20.11,24.09 20.11,25.99 22.02,25.99 20.11,27.9 22.02,18.37 26.46,29.8 26.46,27.9 18.21,27.9 18.21,25.99 18.21,24.09 18.21,22.18 16.3,24.09 16.3,25.99 16.3,27.9 18.21,29.8 16.3,29.8 16.3,31.71
  pour Bottom (rank 2): 13.99,32.32 40.03,32.32 40.03,4.15 13.99,4.15
  pour Top (rank 2): 14.02,32.42 40,32.42 40,4.07 14.02,4.07
(copper drawn outside any net)
  shapes: Top area x1

### Text on the board
tPlace: SOL | - | 12V | MPB | B V A I G